# EAGLE design minimumSystem (1) (EAGLE 9.6.2)
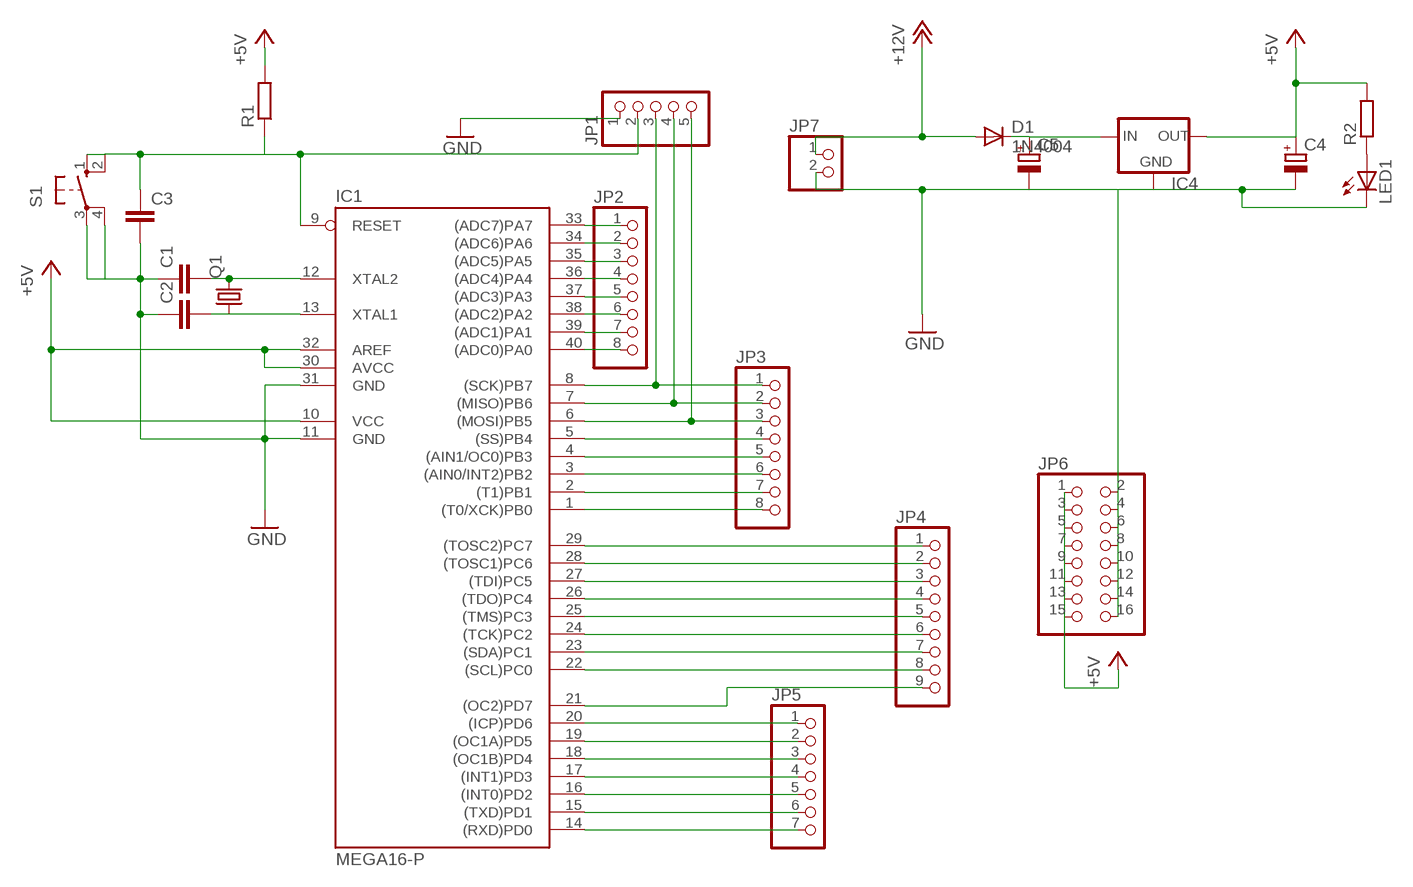
[diagram p0: schematic, sheet 1]

## Parts
C1  C-EU025-024X044  [C025-024X044]
C2  C-EU025-024X044  [C025-024X044]
C3  C-EU050-025X075  [C050-025X075]
C4  CPOL-EUE2.5-5  [E2,5-5]
C5  CPOL-EUE2.5-5  [E2,5-5]
D1  1N4004  [DO41-10]
IC1  MEGA16-P  [DIL40]
IC4  78XXS  [78XXS]
JP1  PINHD-1X5  [1X05]
JP2  PINHD-1X8  [1X08]
JP3  PINHD-1X8  [1X08]
JP4  PINHD-1X9  [1X09]
JP5  PINHD-1X7  [1X07]
JP6  PINHD-2X8  [2X08]
JP7  PINHD-1X2  [1X02]
LED1  LED5MM  [LED5MM]
Q1  CRYSTALHC49U-V  [HC49U-V]
R1  R-EU_0204/7  [0204/7]
R2  R-EU_0204/7  [0204/7]
S1  10-XX  [B3F-10XX]

## Nets
+5V: C4.+ IC1.10(VCC) IC1.30(AVCC) IC1.32(AREF) IC4.OUT JP6.1 JP6.3 JP6.5 JP6.7 JP6.9 JP6.11 JP6.13 JP6.15 R1.2 R2.2
+12V: D1.A JP7.1
C0: IC1.22((SCL)PC0) JP4.8
C1: IC1.23((SDA)PC1) JP4.7
C2: IC1.24((TCK)PC2) JP4.6
C3: IC1.25((TMS)PC3) JP4.5
D7: IC1.14((RXD)PD0) JP5.7
GND: C1.1 C2.1 C3.2 C4.- C5.- IC1.11(GND) IC1.31(GND) IC4.GND JP1.1 JP6.2 JP6.4 JP6.6 JP6.8 JP6.10 JP6.12 JP6.14 JP6.16 JP7.2 LED1.K(C) S1.3(P) S1.4(P1)
N$1: IC1.33((ADC7)PA7) JP2.1
N$2: IC1.34((ADC6)PA6) JP2.2
N$3: IC1.35((ADC5)PA5) JP2.3
N$4: IC1.36((ADC4)PA4) JP2.4
N$5: IC1.37((ADC3)PA3) JP2.5
N$6: IC1.38((ADC2)PA2) JP2.6
N$7: IC1.39((ADC1)PA1) JP2.7
N$8: IC1.40((ADC0)PA0) JP2.8
N$9: R1.1
N$11: IC1.29((TOSC2)PC7) JP4.1
N$12: IC1.28((TOSC1)PC6) JP4.2
N$13: IC1.27((TDI)PC5) JP4.3
N$14: IC1.5((SS)PB4) JP3.4
N$15: IC1.20((ICP)PD6) JP5.1
N$16: IC1.19((OC1A)PD5) JP5.2
N$19: IC1.26((TDO)PC4) JP4.4
N$20: IC1.6((MOSI)PB5) JP1.5 JP3.3
N$21: IC1.4((AIN1/OC0)PB3) JP3.5
N$22: IC1.3((AIN0/INT2)PB2) JP3.6
N$23: IC1.2((T1)PB1) JP3.7
N$24: IC1.1((T0/XCK)PB0) JP3.8
N$25: C5.+ D1.C IC4.IN
N$30: IC1.15((TXD)PD1) JP5.6
N$31: IC1.16((INT0)PD2) JP5.5
N$32: IC1.17((INT1)PD3) JP5.4
N$33: C3.1 IC1.9(RESET) JP1.2 S1.1(S) S1.2(S1)
N$34: IC1.18((OC1B)PD4) JP5.3
N$35: C1.2 IC1.12(XTAL2) Q1.2
N$36: C2.2 IC1.13(XTAL1) Q1.1
N$37: LED1.A R2.1
N$46: IC1.8((SCK)PB7) JP1.3 JP3.1
N$47: IC1.7((MISO)PB6) JP1.4 JP3.2
RS: IC1.21((OC2)PD7) JP4.9

## Library data of the parts
C1 C2 = rcl:C-EU: CAPACITOR, European symbol
C3 = resistor:C-EU: CAPACITOR, European symbol
C4 C5 = rcl:CPOL-EU: POLARIZED CAPACITOR, European symbol
D1 = diode:1N4004: DIODE general purpose rectifier, 1 A
IC1 = atmel:MEGA16-P: MICROCONTROLLER 16 Kbytes FLASH 1 kbytes SRAM 512 bytes EEPROM USART 8-channel 10 bit ADC Source: avr.lbr; MPN: ATMEGA16-16PU; OC_FARNELL: 9171142; OC_NEWARK: 01M6885
IC4 = v-reg:78XXS: VOLTAGE REGULATOR
JP1 = pinhead:PINHD-1X5: PIN HEADER
JP2 JP3 = pinhead:PINHD-1X8: PIN HEADER
JP4 = pinhead:PINHD-1X9: PIN HEADER
JP5 = pinhead:PINHD-1X7: PIN HEADER
JP6 = pinhead:PINHD-2X8: PIN HEADER
JP7 = pinhead:PINHD-1X2: PIN HEADER
LED1 = led:LED: LED OSRAM: - CHIPLED LG R971, LG N971, LY N971, LG Q971, LY Q971, LO R971, LY R971 LH N974, LH R974 LS Q976, LO Q976, LY Q976 LO Q996 - Hyper CHIPLED LW Q18S LB Q993, LB Q99A, LB R99A - SideLED LS A670, LO A670, LY A670, LG A670, LP A670 LB A673, LV A673, LT A673, LW A673 LH A674 LY A675 LS A676, LA A676, LO A676, LY A676, LW A676 LS A679, LY A679, LG A679 - Hyper Micro SIDELED® LS Y876, LA Y876, LO Y876, LY Y876 LT Y87S - SmartLED LW L88C, LW L88S LB L89C, LB L89S, LG L890 LS L89K, LO L89K, LY L89K LS L896, LA L896, LO L896, LY L896 - TOPLED LS T670, LO T670, LY T670, LG T670, LP T670 LSG T670, LSP T670, LSY T670, LOP T670, LYG T670 LG T671, LOG T671, LSG T671 LB T673, LV T673, LT T673, LW T673 LH T674 LS T676, LA T676, LO T676, LY T676, LB T676, LH T676, LSB T676, LW T676 LB T67C, LV T67C, LT T67C, LS T67K, LO T67K, LY T67K, LW E67C LS E67B, LA E67B, LO E67B, LY E67B, LB E67C, LV E67C, LT E67C LW T67C LS T679, LY T679, LG T679 LS T770, LO T770, LY T770, LG T770, LP T770 LB T773, LV T773, LT T773, LW T773 LH T774 LS E675, LA E675, LY E675, LS T675 LS T776, LA T776, LO T776, LY T776, LB T776 LHGB T686 LT T68C, LB T68C - Hyper Mini TOPLED® LB M676 - Mini TOPLED Santana® LG M470 LS M47K, LO M47K, LY M47K Source: http://www.osram.convergy.de LUXEON: - LUMILED® LXK2-PW12-R00, LXK2-PW12-S00, LXK2-PW14-U00, LXK2-PW14-V00 LXK2-PM12-R00, LXK2-PM12-S00, LXK2-PM14-U00 LXK2-PE12-Q00, LXK2-PE12-R00, LXK2-PE12-S00, LXK2-PE14-T00, LXK2-PE14-U00 LXK2-PB12-K00, LXK2-PB12-L00, LXK2-PB12-M00, LXK2-PB14-N00, LXK2-PB14-P00, LXK2-PB14-Q00 LXK2-PR12-L00, LXK2-PR12-M00, LXK2-PR14-Q00, LXK2-PR14-R00 LXK2-PD12-Q00, LXK2-PD12-R00, LXK2-PD12-S00 LXK2-PH12-R00, LXK2-PH12-S00 LXK2-PL12-P00, LXK2-PL12-Q00, LXK2-PL12-R00 Source: www.luxeon.com KINGBRIGHT: KA-3528ASYC Source: www.kingbright.com
Q1 = crystal:CRYSTAL: CRYSTAL; OC_FARNELL: 1666969; OC_NEWARK: unknown
R1 R2 = rcl:R-EU_: RESISTOR, European symbol
S1 = switch-omron:10-XX: OMRON SWITCH; MPN: B3F-1000; OC_FARNELL: 176432; OC_NEWARK: 36M3542

## Board
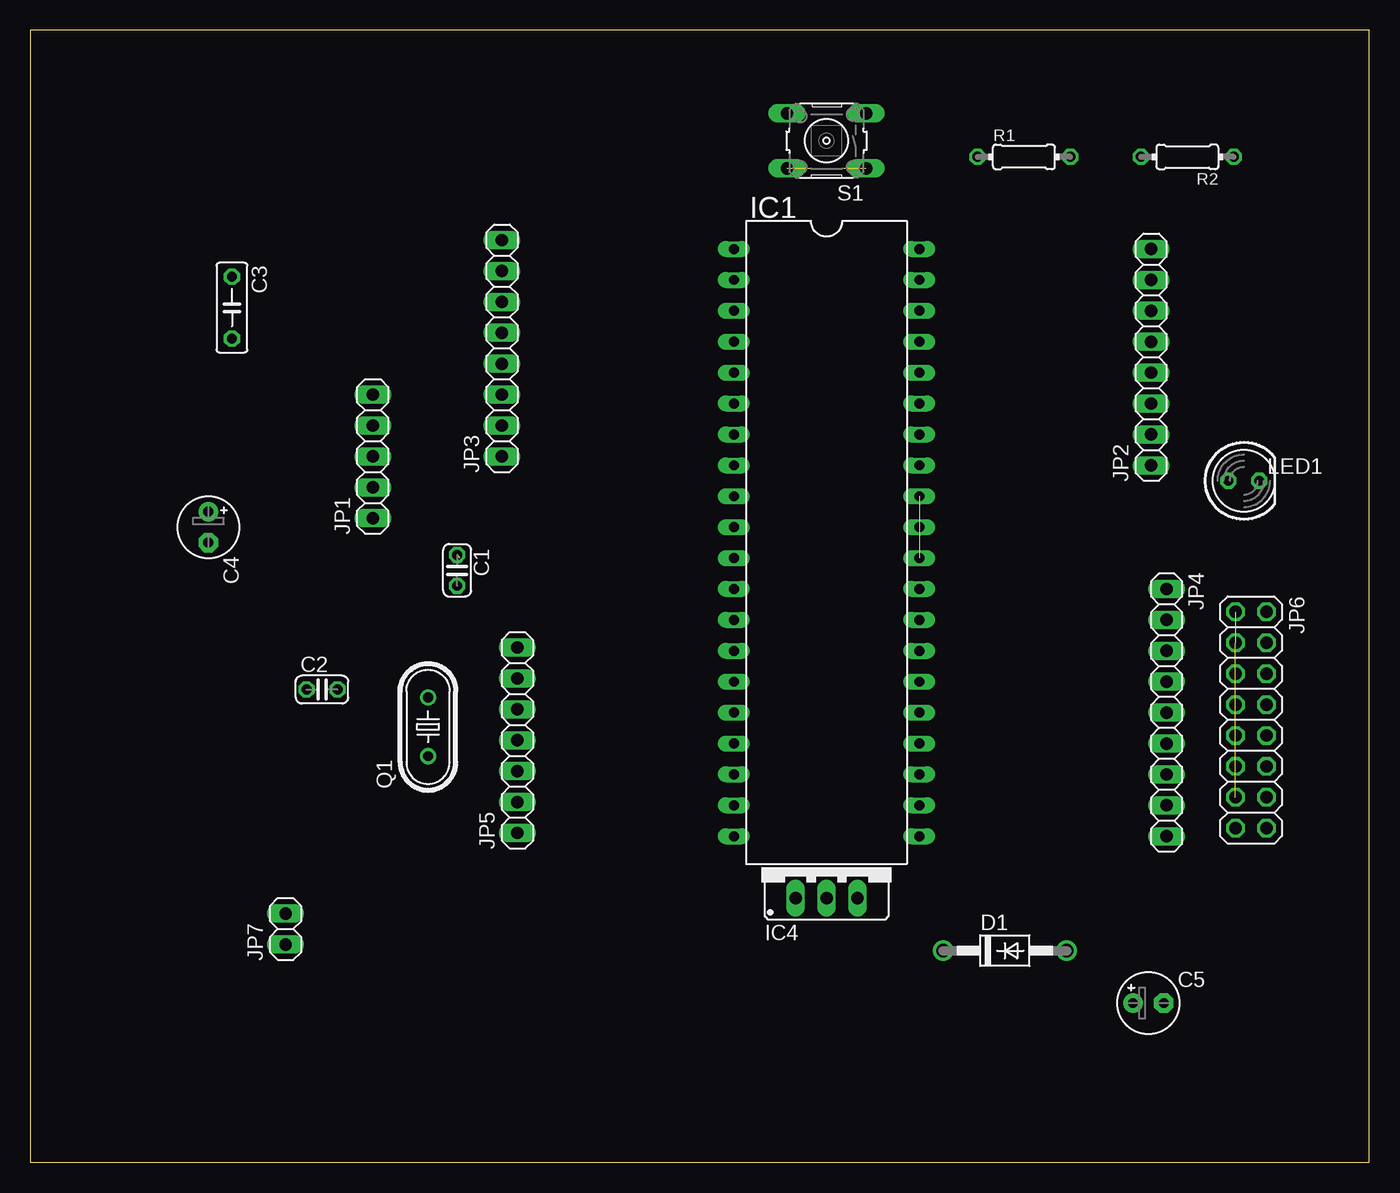
[diagram p1: board, top side]
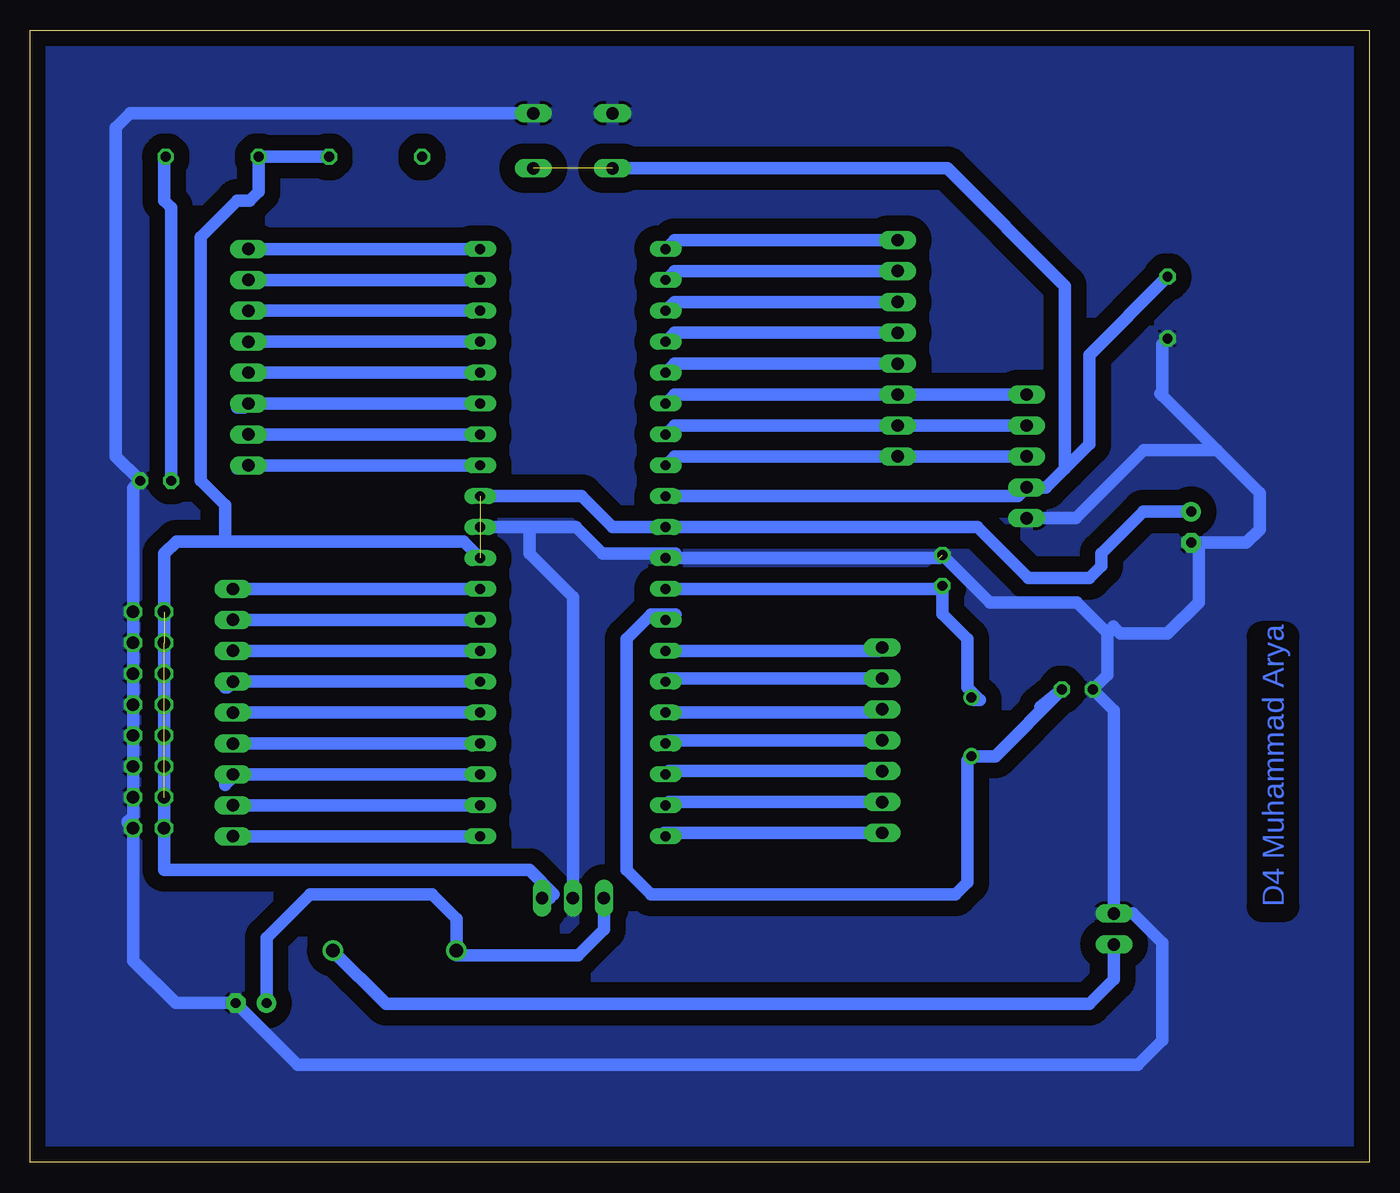
[diagram p2: board, bottom side, seen from below]

Size 110 x 93 mm. Coordinates in mm from the lower left corner, seen from the top.
Outline: 0,0 110,0 110,93 0,93 0,0
Copper layers (1*16): Top 0.035mm / dielectric 1.5mm / Bottom 0.035mm
Design rules "default": minimum track width 6mil, minimum drill 0.35mm, track to track 6mil, track to pad 6mil, pad to pad 6mil, via to via 6mil, smd to smd 6mil, copper to edge 40mil, drill to drill 6mil, minimum pad ring 10mil, minimum via ring 8mil, stop-mask expansion 4mil, vias tented up to drill 0mil, thermal gap 10mil

### Footprints (pad centres in the part's own frame; a part is rotated, then mirrored left to right if it is on the bottom)
C025-024X044 = drill 0.813 octagon: 1 -1.27,0; 2 1.27,0
C050-025X075 = drill 0.813 octagon: 1 -2.54,0; 2 2.54,0
E2,5-5 = drill 0.813 pad 1.6: + -1.27,0 | drill 0.813 pad 1.6 octagon: - 1.27,0
DO41-10 = drill 1.118: A 5.08,0; C -5.08,0
DIL40 = drill 0.813 long: 1 -24.13,-7.62; 2 -21.59,-7.62; 3 -19.05,-7.62; 4 -16.51,-7.62; 5 -13.97,-7.62; 6 -11.43,-7.62; 7 -8.89,-7.62; 8 -6.35,-7.62; 9 -3.81,-7.62; 10 -1.27,-7.62; 11 1.27,-7.62; 12 3.81,-7.62; 13 6.35,-7.62; 14 8.89,-7.62; 15 11.43,-7.62; 16 13.97,-7.62; 17 16.51,-7.62; 18 19.05,-7.62; 19 21.59,-7.62; 20 24.13,-7.62; 21 24.13,7.62; 22 21.59,7.62; 23 19.05,7.62; 24 16.51,7.62; 25 13.97,7.62; 26 11.43,7.62; 27 8.89,7.62; 28 6.35,7.62; 29 3.81,7.62; 30 1.27,7.62; 31 -1.27,7.62; 32 -3.81,7.62; 33 -6.35,7.62; 34 -8.89,7.62; 35 -11.43,7.62; 36 -13.97,7.62; 37 -16.51,7.62; 38 -19.05,7.62; 39 -21.59,7.62; 40 -24.13,7.62
78XXS = drill 1.016 long: GND 0,-2.54; IN -2.54,-2.54; OUT 2.54,-2.54
1X05 = drill 1.016 long: 1 -5.08,0; 2 -2.54,0; 3 0,0; 4 2.54,0; 5 5.08,0
1X08 = drill 1.016 long: 1 -8.89,0; 2 -6.35,0; 3 -3.81,0; 4 -1.27,0; 5 1.27,0; 6 3.81,0; 7 6.35,0; 8 8.89,0
1X09 = drill 1.016 long: 1 -10.16,0; 2 -7.62,0; 3 -5.08,0; 4 -2.54,0; 5 0,0; 6 2.54,0; 7 5.08,0; 8 7.62,0; 9 10.16,0
1X07 = drill 1.016 long: 1 -7.62,0; 2 -5.08,0; 3 -2.54,0; 4 0,0; 5 2.54,0; 6 5.08,0; 7 7.62,0
2X08 = drill 1.016 octagon: 1 -8.89,-1.27; 2 -8.89,1.27; 3 -6.35,-1.27; 4 -6.35,1.27; 5 -3.81,-1.27; 6 -3.81,1.27; 7 -1.27,-1.27; 8 -1.27,1.27; 9 1.27,-1.27; 10 1.27,1.27; 11 3.81,-1.27; 12 3.81,1.27; 13 6.35,-1.27; 14 6.35,1.27; 15 8.89,-1.27; 16 8.89,1.27
1X02 = drill 1.016 long: 1 -1.27,0; 2 1.27,0
LED5MM = drill 0.813 octagon: A -1.27,0; K 1.27,0
HC49U-V = drill 0.813: 1 -2.413,0; 2 2.413,0
0204/7 = drill 0.813 octagon: 1 -3.81,0; 2 3.81,0
B3F-10XX = drill 1.016 long: 1 -3.251,2.261; 2 3.251,2.261; 3 -3.251,-2.261; 4 3.251,-2.261

### Placement (x,y rotation side)
C1  35.06,48.63 270 top
C2  23.96,38.84 0 top
C3  16.56,70.22 270 top
C4  14.62,52.18 270 top
C5  91.86,13.07 0 top
D1  80.07,17.38 0 top
IC1  65.42,50.91 270 top
IC4  65.42,24.24 0 top
JP1  28.13,57.99 90 top
JP2  92.09,66.15 90 top
JP3  38.75,66.88 90 top
JP4  93.36,36.94 270 top
JP5  40.02,34.67 90 top
JP6  100.29,36.33 270 top
JP7  20.97,19.16 90 top
LED1  99.71,55.99 0 top
Q1  32.67,35.77 90 top
R1  81.64,82.61 0 top
R2  95.07,82.61 180 top
S1  65.42,83.93 180 top

### Tracks (layer width: path | path; a pad name or v marks a point on that pad's centre or on a via)
+5V  (7 unrouted)
  Bottom 1.016: C4.+ 18.55,53.45 22,50 22,49 23,48 28,48 32.18,52.18 IC1.10 62.18,52.18 64.72,54.72 IC1.32 | JP6.15 JP6.1 | JP6.1 99.02,24.02 99,24 69,24 67,22 67.3,21.7 IC4.OUT | JP6.1 99,45.24 99,50 98,51 94,51 | IC1.30 74.4,51 94,51 | R1.2 R2.2 91.26,79.74 92,79 93,79 96,76 96,56 94,54 94,51
+12V
  Bottom 1.016: D1.A 80.77,13 23,13 20.97,15.03 JP7.1
C0
  Bottom 1.016: IC1.22 JP4.8
C1
  Bottom 1.016: IC1.23 93.14,31.86 94,31 94,31.22 JP4.7
C2
  Bottom 1.016: IC1.24 JP4.6
C3
  Bottom 1.016: IC1.25 JP4.5
D7
  Bottom 1.016: IC1.14 40.29,42.02 JP5.7
GND  (1 unrouted)
  Bottom 1.016: 21.5,43.5 21.44,43.44 | IC1.31 69,52.18 | 69,52.18 65.18,52.18 63,50 57,50 57.36,49.64 IC1.11 35.32,49.64 | IC4.GND 65.42,46.42 69,50 69,52.18 | 12.5,58.5 17,63 | 17,63 17.16,63.16 | 12.5,58.5 9,55 9,52 10.09,50.91 C4.- 14,50.29 14,46 16.56,43.44 20.44,43.44 21,44 | JP1.1 24.09,52.91 18.5,58.5 12.5,58.5 | S1.3 101.81,86.19 103,85 103,58 LED1.K 101.56,55.41 JP6.2 101.56,28.44 102,28 102,27.88 JP6.16 101.56,16.56 98.07,13.07 C5.- 88.06,8 19,8 17,10 17,18 19.43,20.43 JP7.2 20.97,37.12 C2.1 21.5,40.03 21.5,43.5 | S1.3 68.19,86.19 68,86 68.48,86 S1.3 | C1.1 31.16,46 24,46 21.5,43.5 | C3.2 17,67.24 17,63
  pour Bottom (isolate 1.27): 1,93 1,1 110,1 110,93 2,93 2,91
N$1
  Bottom 1.016: IC1.33 JP2.1 | JP2.1 92.74,57.26 93,57 92.35,57 JP2.1
N$2
  Bottom 1.016: IC1.34 JP2.2
N$3
  Bottom 1.016: IC1.35 JP2.3 | JP2.3 92.66,62.34 93,62 92.43,62 JP2.3
N$4
  Bottom 1.016: IC1.36 JP2.4
N$5
  Bottom 1.016: IC1.37 JP2.5
N$6
  Bottom 1.016: IC1.38 JP2.6 | JP2.6 92.96,69.96 93,70 92.13,70 JP2.6
N$7
  Bottom 1.016: IC1.39 JP2.7
N$8
  Bottom 1.016: IC1.40 JP2.8
N$11
  Bottom 1.016: IC1.29 JP4.1 | JP4.1 93.9,47.1 94,47 93.46,47 JP4.1
N$12
  Bottom 1.016: IC1.28 JP4.2
N$13
  Bottom 1.016: IC1.27 JP4.3
N$14
  Bottom 1.016: JP3.4 57.07,65.61 IC1.5
N$15
  Bottom 1.016: JP5.1 57.95,27.05 58,27 58,26.98 IC1.20
N$16
  Bottom 1.016: JP5.2 57.53,29.59 IC1.19
N$19
  Bottom 1.016: IC1.26 JP4.4 | JP4.4 93.52,39.48 94,39 93.84,39 JP4.4
N$20
  Bottom 1.016: IC1.6 57.07,63.07 JP3.3 JP1.5
N$21
  Bottom 1.016: JP3.5 57.07,68.15 IC1.4
N$22
  Bottom 1.016: JP3.6 57.07,70.69 IC1.3
N$23
  Bottom 1.016: JP3.7 57.07,73.23 IC1.2
N$24
  Bottom 1.016: JP3.8 57.07,75.77 IC1.1
N$25
  Bottom 1.016: IC4.IN 62.88,19.12 65,17 74.61,17 | 74.61,17 75,17 | 74.61,17 D1.C 75,20 77,22 87,22 90.59,18.41 C5.+
N$30
  Bottom 1.016: JP5.6 57.53,39.75 IC1.15
N$31
  Bottom 1.016: IC1.16 40.29,36.94 JP5.5
N$32
  Bottom 1.016: JP5.4 57.53,34.67 IC1.17
N$33  (1 unrouted)
  Bottom 1.016: IC1.9 28.86,54.72 JP1.2 26.55,55.45 25,57 | S1.2 34.67,81.67 25,72 25,57 | C3.1 23,66.32 23,59 25,57
N$34
  Bottom 1.016: JP5.3 57.53,32.13 IC1.18
N$35
  Bottom 1.016: Q1.2 32.49,38 32,38 33,39 33,43 35.06,45.06 C1.2 35.32,47.1 IC1.12
N$36
  Bottom 1.016: IC1.13 57.44,44.56 57,45 59,45 61,43 61,24 59,22 34,22 33,23 33,33.03 Q1.1 30.71,33.36 C2.2 27,37.39
N$37
  Bottom 1.016: LED1.A 98.44,78.44 99,79 99,82.49 R2.1
N$46
  Bottom 1.016: IC1.8 57.07,57.99 JP3.1 JP1.3
N$47
  Bottom 1.016: IC1.7 57.07,60.53 JP3.2 JP1.4
RS
  Bottom 1.016: IC1.21 JP4.9

### Text on the board
Bottom: D4 Muhammad Arya